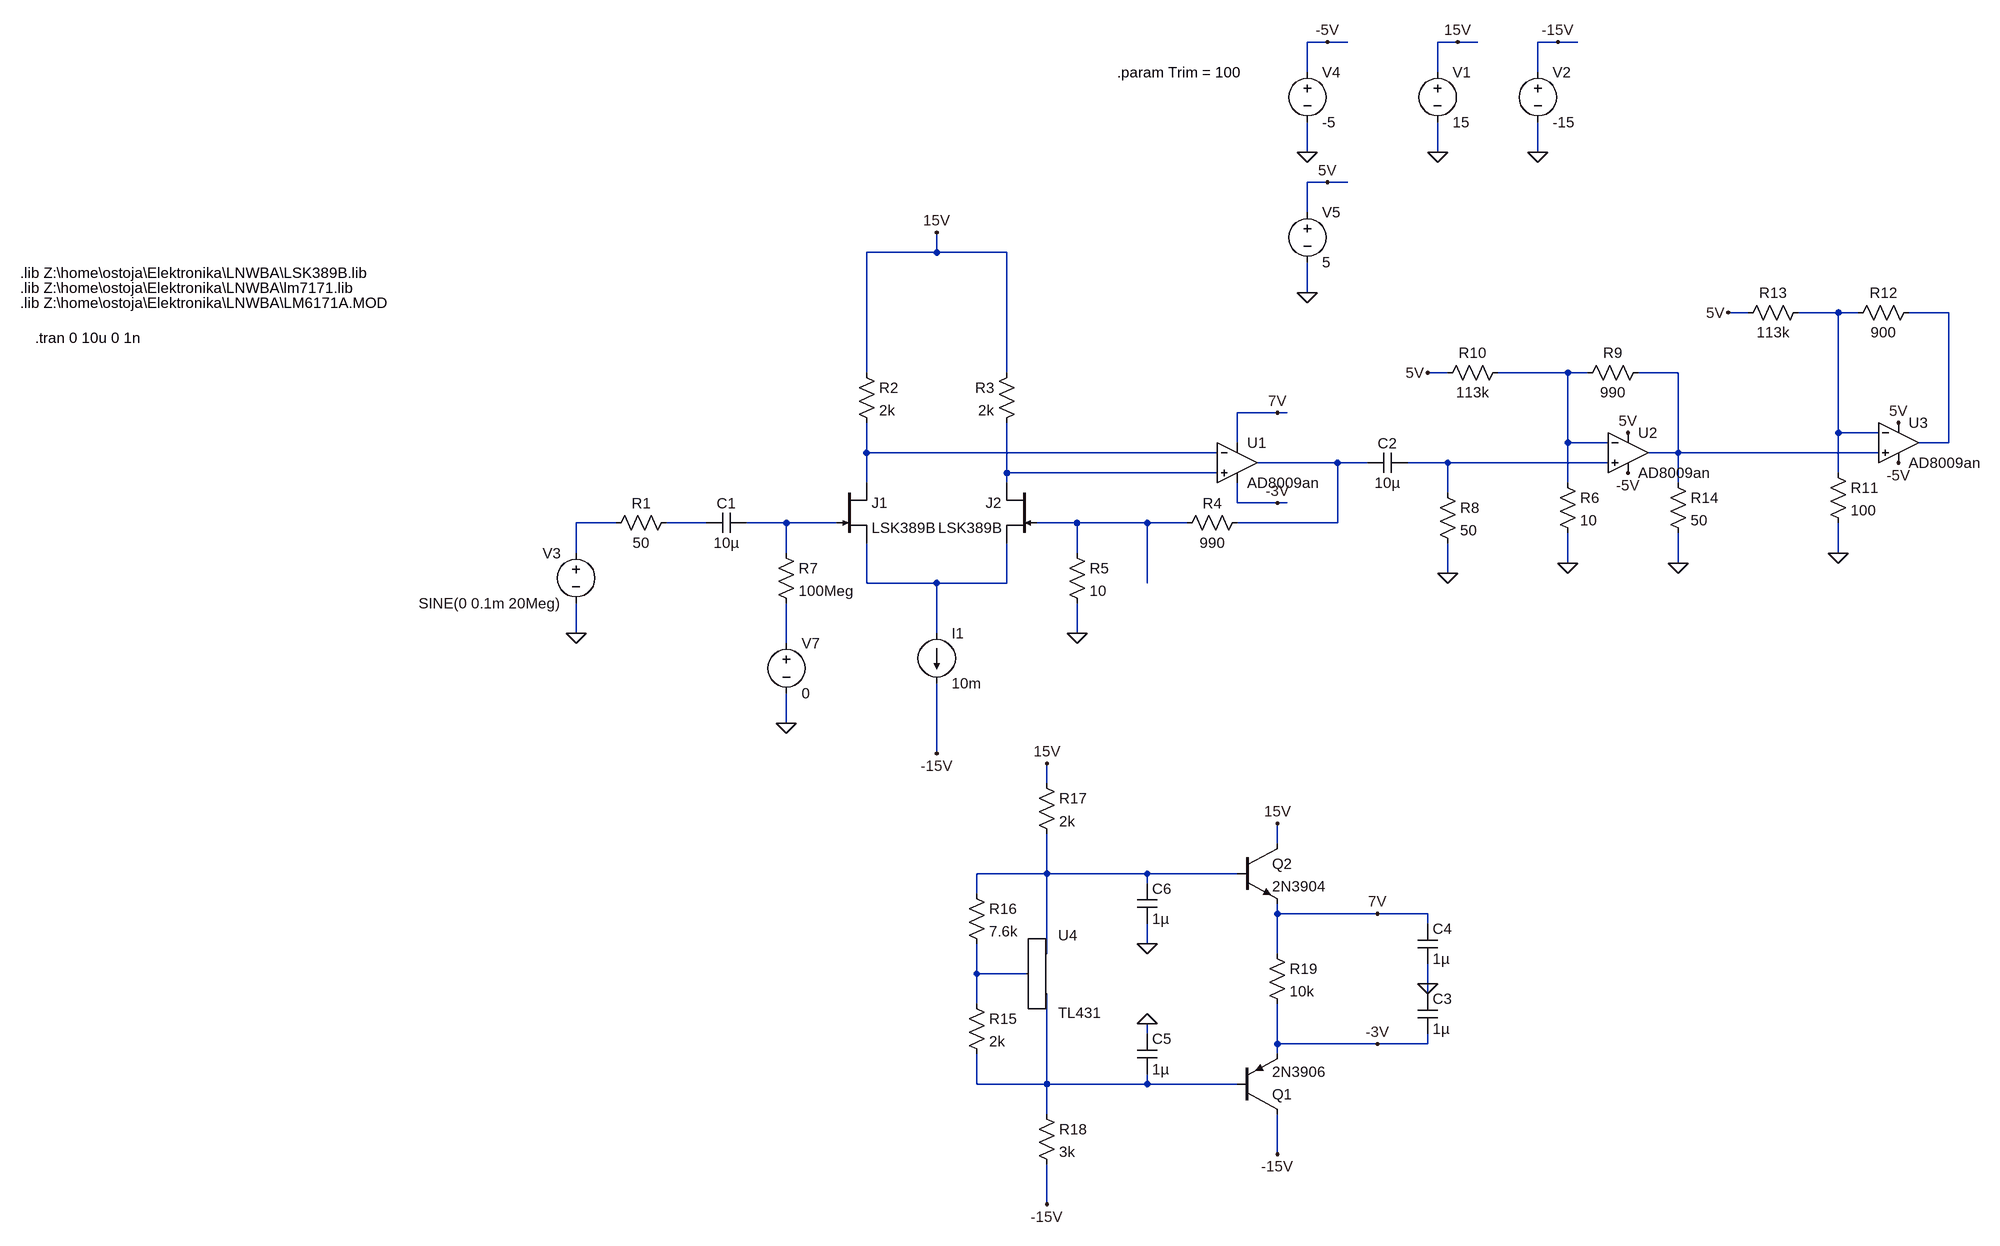
[diagram p0: schematic LNWB_BJT.asc]
LNWB_BJT.asc, the LTspice schematic file:
Version 4
SHEET 1 2516 1364
WIRE 896 -592 864 -592
WIRE 928 -592 896 -592
WIRE 1104 -592 1072 -592
WIRE 1136 -592 1104 -592
WIRE 1264 -592 1232 -592
WIRE 1296 -592 1264 -592
WIRE 864 -544 864 -592
WIRE 1072 -544 1072 -592
WIRE 1232 -544 1232 -592
WIRE 864 -416 864 -464
WIRE 1072 -416 1072 -464
WIRE 1232 -416 1232 -464
WIRE 896 -368 864 -368
WIRE 928 -368 896 -368
WIRE 864 -320 864 -368
WIRE 272 -256 272 -288
WIRE 272 -256 160 -256
WIRE 384 -256 272 -256
WIRE 864 -192 864 -240
WIRE 1568 -160 1536 -160
WIRE 1712 -160 1648 -160
WIRE 1744 -160 1712 -160
WIRE 1888 -160 1824 -160
WIRE 160 -64 160 -256
WIRE 384 -64 384 -256
WIRE 1088 -64 1056 -64
WIRE 1280 -64 1168 -64
WIRE 1312 -64 1280 -64
WIRE 1456 -64 1392 -64
WIRE 816 0 752 0
WIRE 832 0 816 0
WIRE 1712 32 1712 -160
WIRE 1776 32 1712 32
WIRE 752 48 752 0
WIRE 1280 48 1280 -64
WIRE 1344 48 1280 48
WIRE 1888 48 1888 -160
WIRE 1888 48 1840 48
WIRE 160 64 160 16
WIRE 720 64 160 64
WIRE 1456 64 1456 -64
WIRE 1456 64 1408 64
WIRE 1776 64 1456 64
WIRE 912 80 784 80
WIRE 960 80 912 80
WIRE 1088 80 1024 80
WIRE 1344 80 1088 80
WIRE 384 96 384 16
WIRE 720 96 384 96
WIRE 1712 96 1712 32
WIRE 160 112 160 64
WIRE 384 112 384 96
WIRE 1280 112 1280 48
WIRE 1456 112 1456 64
WIRE 1088 128 1088 80
WIRE 752 144 752 112
WIRE 816 144 752 144
WIRE 832 144 816 144
WIRE -240 176 -304 176
WIRE -96 176 -160 176
WIRE 32 176 -32 176
WIRE 112 176 32 176
WIRE 496 176 432 176
WIRE 608 176 496 176
WIRE 672 176 608 176
WIRE 912 176 912 80
WIRE 912 176 752 176
WIRE -304 224 -304 176
WIRE 32 224 32 176
WIRE 496 224 496 176
WIRE 1712 224 1712 176
WIRE 1280 240 1280 192
WIRE 1456 240 1456 192
WIRE 1088 256 1088 208
WIRE 160 272 160 208
WIRE 272 272 160 272
WIRE 384 272 384 208
WIRE 384 272 272 272
WIRE 608 272 608 176
WIRE -304 352 -304 304
WIRE 272 352 272 272
WIRE 496 352 496 304
WIRE 32 368 32 304
WIRE 32 496 32 448
WIRE 272 544 272 432
WIRE 448 592 448 560
WIRE 816 688 816 656
WIRE 448 736 448 672
WIRE 448 736 336 736
WIRE 608 736 448 736
WIRE 752 736 608 736
WIRE 608 752 608 736
WIRE 336 768 336 736
WIRE 816 800 816 784
WIRE 976 800 816 800
WIRE 1056 800 976 800
WIRE 1056 816 1056 800
WIRE 608 848 608 816
WIRE 448 864 448 736
WIRE 816 864 816 800
WIRE 336 896 336 848
WIRE 416 896 336 896
WIRE 1056 912 1056 880
WIRE 1056 928 1056 912
WIRE 336 944 336 896
WIRE 608 992 608 976
WIRE 816 1008 816 944
WIRE 976 1008 816 1008
WIRE 1056 1008 1056 992
WIRE 1056 1008 976 1008
WIRE 816 1024 816 1008
WIRE 336 1072 336 1024
WIRE 448 1072 448 928
WIRE 448 1072 336 1072
WIRE 608 1072 608 1056
WIRE 608 1072 448 1072
WIRE 752 1072 608 1072
WIRE 448 1120 448 1072
WIRE 816 1184 816 1120
WIRE 448 1264 448 1200
FLAG 1104 -592 15V
FLAG 1264 -592 -15V
FLAG 1232 -416 0
FLAG 1072 -416 0
FLAG 272 -288 15V
FLAG 272 544 -15V
FLAG -304 352 0
FLAG 496 352 0
FLAG 896 -592 -5V
FLAG 864 -416 0
FLAG 1088 256 0
FLAG 896 -368 5V
FLAG 864 -192 0
FLAG 32 496 0
FLAG 1376 32 5V
FLAG 1376 96 -5V
FLAG 1280 240 0
FLAG 1808 16 5V
FLAG 1808 80 -5V
FLAG 1712 224 0
FLAG 1536 -160 5V
FLAG 1456 240 0
FLAG 1056 -64 5V
FLAG 448 560 15V
FLAG 448 1264 -15V
FLAG 816 1184 -15V
FLAG 816 656 15V
FLAG 976 800 7V
FLAG 976 1008 -3V
FLAG 816 0 7V
FLAG 816 144 -3V
FLAG 1056 912 0
FLAG 608 976 0
FLAG 608 848 0
SYMBOL njf 112 112 R0
SYMATTR InstName J1
SYMATTR Value LSK389B
SYMBOL voltage 1072 -560 R0
WINDOW 123 0 0 Left 0
WINDOW 39 0 0 Left 0
SYMATTR InstName V1
SYMATTR Value 15
SYMBOL voltage 1232 -560 R0
WINDOW 123 0 0 Left 0
WINDOW 39 0 0 Left 0
SYMATTR InstName V2
SYMATTR Value -15
SYMBOL voltage -304 208 M0
WINDOW 123 0 0 Left 0
WINDOW 39 0 0 Left 0
SYMATTR InstName V3
SYMATTR Value SINE(0 0.1m 20Meg)
SYMBOL res 144 -80 R0
SYMATTR InstName R2
SYMATTR Value 2k
SYMBOL njf 432 112 M0
SYMATTR InstName J2
SYMATTR Value LSK389B
SYMBOL res 400 -80 M0
SYMATTR InstName R3
SYMATTR Value 2k
SYMBOL res 768 160 R90
WINDOW 0 0 56 VBottom 2
WINDOW 3 32 56 VTop 2
SYMATTR InstName R4
SYMATTR Value 990
SYMBOL res 480 208 R0
SYMATTR InstName R5
SYMATTR Value 10
SYMBOL voltage 864 -560 R0
WINDOW 123 0 0 Left 0
WINDOW 39 0 0 Left 0
SYMATTR InstName V4
SYMATTR Value -5
SYMBOL cap -32 160 R90
WINDOW 0 0 32 VBottom 2
WINDOW 3 32 32 VTop 2
SYMATTR InstName C1
SYMATTR Value 10µ
SYMBOL res -144 160 R90
WINDOW 0 0 56 VBottom 2
WINDOW 3 32 56 VTop 2
SYMATTR InstName R1
SYMATTR Value 50
SYMBOL res 16 208 R0
SYMATTR InstName R7
SYMATTR Value 100Meg
SYMBOL cap 1024 64 R90
WINDOW 0 0 32 VBottom 2
WINDOW 3 32 32 VTop 2
SYMATTR InstName C2
SYMATTR Value 10µ
SYMBOL res 1072 112 R0
SYMATTR InstName R8
SYMATTR Value 50
SYMBOL voltage 864 -336 R0
WINDOW 123 0 0 Left 0
WINDOW 39 0 0 Left 0
SYMATTR InstName V5
SYMATTR Value 5
SYMBOL voltage 32 352 R0
WINDOW 123 0 0 Left 0
WINDOW 39 0 0 Left 0
SYMATTR InstName V7
SYMATTR Value 0
SYMBOL current 272 352 R0
WINDOW 123 0 0 Left 0
WINDOW 39 0 0 Left 0
SYMATTR InstName I1
SYMATTR Value 10m
SYMBOL res 1264 96 R0
SYMATTR InstName R6
SYMATTR Value 10
SYMBOL res 1296 -48 R270
WINDOW 0 32 56 VTop 2
WINDOW 3 0 56 VBottom 2
SYMATTR InstName R9
SYMATTR Value 990
SYMBOL ZZZ\\OpAmp\\AD8009an 1376 64 R0
SYMATTR InstName U2
SYMBOL res 1696 80 R0
SYMATTR InstName R11
SYMATTR Value 100
SYMBOL res 1728 -144 R270
WINDOW 0 32 56 VTop 2
WINDOW 3 0 56 VBottom 2
SYMATTR InstName R12
SYMATTR Value 900
SYMBOL ZZZ\\OpAmp\\AD8009an 1808 48 R0
SYMATTR InstName U3
SYMBOL res 1552 -144 R270
WINDOW 0 32 56 VTop 2
WINDOW 3 0 56 VBottom 2
SYMATTR InstName R13
SYMATTR Value 113k
SYMBOL res 1440 96 R0
SYMATTR InstName R14
SYMATTR Value 50
SYMBOL ZZZ\\OpAmp\\AD8009an 752 80 R0
SYMATTR InstName U1
SYMBOL res 1072 -48 R270
WINDOW 0 32 56 VTop 2
WINDOW 3 0 56 VBottom 2
SYMATTR InstName R10
SYMATTR Value 113k
SYMBOL ZZZ\\REF\\TL431 432 864 R0
SYMATTR InstName U4
SYMBOL res 320 928 R0
SYMATTR InstName R15
SYMATTR Value 2k
SYMBOL res 320 752 R0
SYMATTR InstName R16
SYMATTR Value 7.6k
SYMBOL res 432 576 R0
SYMATTR InstName R17
SYMATTR Value 2k
SYMBOL res 432 1104 R0
SYMATTR InstName R18
SYMATTR Value 3k
SYMBOL pnp 752 1120 M180
SYMATTR InstName Q1
SYMATTR Value 2N3906
SYMBOL res 800 848 R0
SYMATTR InstName R19
SYMATTR Value 10k
SYMBOL npn 752 688 R0
SYMATTR InstName Q2
SYMATTR Value 2N3904
SYMBOL cap 1040 928 R0
SYMATTR InstName C3
SYMATTR Value 1µ
SYMBOL cap 1040 816 R0
SYMATTR InstName C4
SYMATTR Value 1µ
SYMBOL cap 592 992 R0
SYMATTR InstName C5
SYMATTR Value 1µ
SYMBOL cap 592 752 R0
SYMATTR InstName C6
SYMATTR Value 1µ
TEXT -1192 -224 Left 2 !.lib Z:\\home\\ostoja\\Elektronika\\LNWBA\\LSK389B.lib
TEXT -1168 -120 Left 2 !.tran 0 10u 0 1n
TEXT -1192 -200 Left 2 !.lib Z:\\home\\ostoja\\Elektronika\\LNWBA\\lm7171.lib
TEXT -1192 -176 Left 2 !.lib Z:\\home\\ostoja\\Elektronika\\LNWBA\\LM6171A.MOD
TEXT 560 -544 Left 2 !.param Trim = 100

The netlist it stands for:
* LNWB_BJT.asc
J1 N005 N011 N013 LSK389B
V1 15V 0 15
V2 -15V 0 -15
V3 N009 0 SINE(0 0.1m 20Meg)
R2 15V N005 2k
J2 N008 N012 N013 LSK389B
R3 15V N008 2k
R4 N006 N012 990
R5 N012 0 10
V4 -5V 0 -5
C1 N011 N010 10µ
R1 N010 N009 50
R7 N011 N014 100Meg
C2 N007 N006 10µ
R8 N007 0 50
V5 5V 0 5
V7 N014 0 0
I1 N013 -15V 10m
R6 N003 0 10
R9 N003 N004 990
* U2: AD8009an (symbol ZZZ\OpAmp\AD8009an not available, pins judged from their places): In+=N007 In-=N003 V+=5V V-=-5V OUT=N004
R11 N001 0 100
R12 N001 N002 900
* U3: AD8009an (symbol ZZZ\OpAmp\AD8009an not available, pins judged from their places): In+=N004 In-=N001 V+=5V V-=-5V OUT=N002
R13 5V N001 113k
R14 N004 0 50
* U1: AD8009an (symbol ZZZ\OpAmp\AD8009an not available, pins judged from their places): In+=N008 In-=N005 V+=7V V-=-3V OUT=N006
R10 5V N003 113k
XU4 N016 N017 N015 TL431
R15 N016 N017 2k
R16 N015 N016 7.6k
R17 15V N015 2k
R18 N017 -15V 3k
Q1 -15V N017 -3V 0 2N3906
R19 7V -3V 10k
Q2 15V N015 7V 0 2N3904
C3 0 -3V 1µ
C4 7V 0 1µ
C5 0 N017 1µ
C6 N015 0 1µ
.model NPN NPN
.model PNP PNP
.lib standard.bjt
.model NJF NJF
.model PJF PJF
.lib standard.jft
.lib Z:\home\ostoja\Elektronika\LNWBA\LSK389B.lib
.tran 0 10u 0 1n
.lib Z:\home\ostoja\Elektronika\LNWBA\lm7171.lib
.lib Z:\home\ostoja\Elektronika\LNWBA\LM6171A.MOD
.param Trim = 100
.lib TL431.mod
.backanno
.end